# Altium project STM32 Flight Controller.PrjPcb
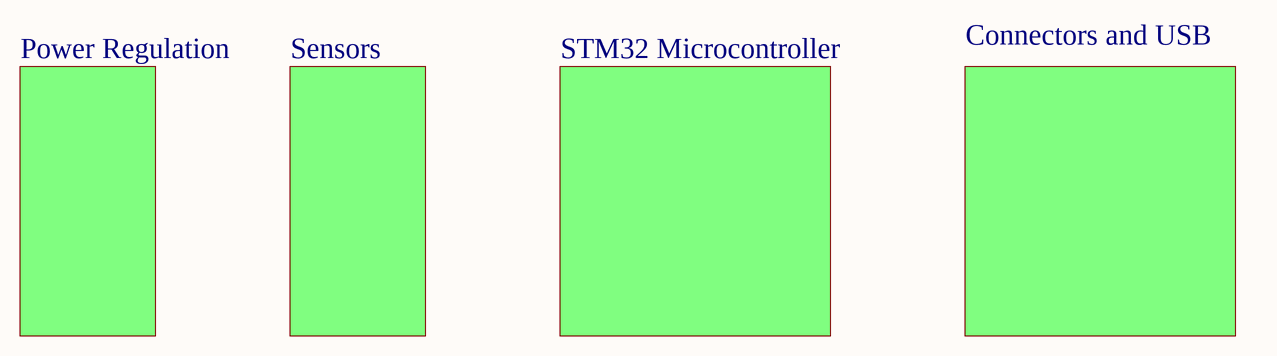
[diagram p0: Top Level.SchDoc]
5 sheets, 52 parts. Net scope: global (net labels, ports and power ports of the same name join across sheets).
Board file: FlightController.PcbDoc
Sheets:
  Top Level.SchDoc
    STM32 Microcontroller = STM32.SchDoc
    Connectors and USB = Connectors and USB.SchDoc
    Sensors = Sensors.SchDoc
    Power Regulation = Power Regulation.SchDoc

## Sheet Top Level.SchDoc: Top Level
size A4; DrawnBy: Alex Dyer; Revision: A; SheetNumber: 1; SheetTotal: 5

### Sub-sheets
Connectors and USB = Connectors and USB.SchDoc: no entries
Power Regulation = Power Regulation.SchDoc: no entries
Sensors = Sensors.SchDoc: no entries
STM32 Microcontroller = STM32.SchDoc: no entries

### Notes on the sheet
- Title:
- Size:
- Date:
- A4
- Drawn By:
- Time:
- Sheet
- Revision:
- of

## Sheet STM32.SchDoc: STM32
size A4; DrawnBy: Alex Dyer; Revision: A; SheetNumber: 2; SheetTotal: 5
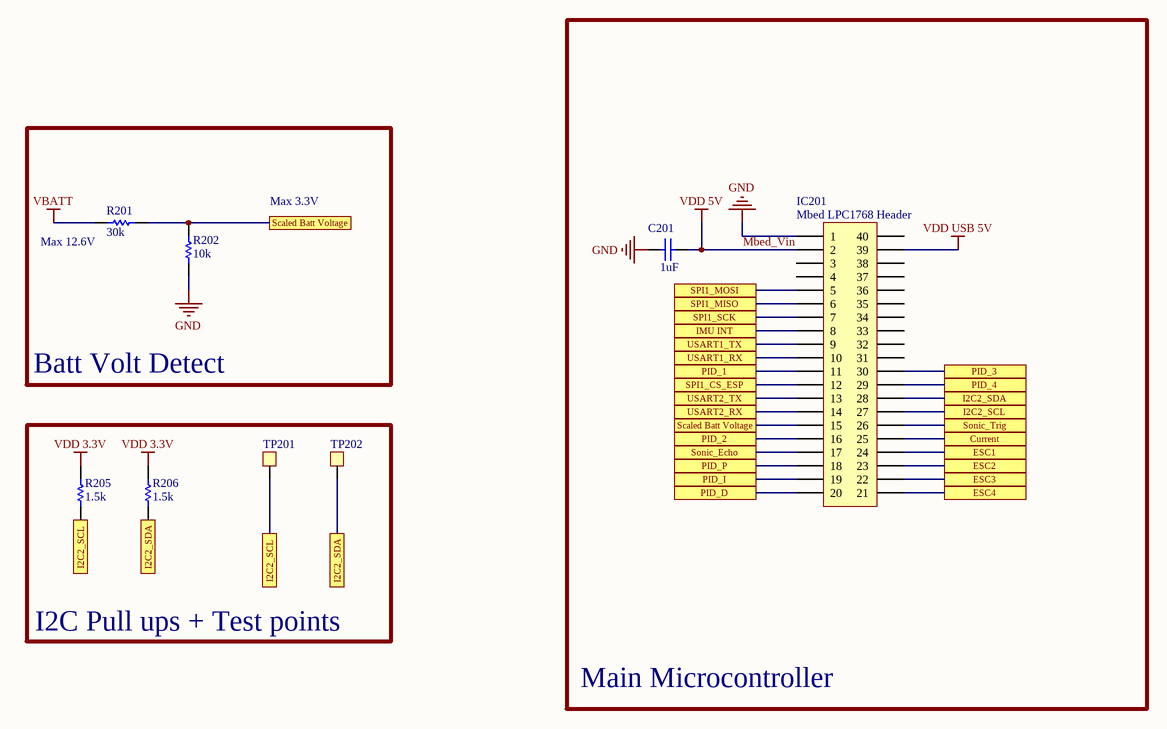
[diagram p1: STM32.SchDoc]

### Parts
C201  value 1uF  [0805 Cap]  (hidden comment: 0805)
IC201  Mbed LPC1768 Header  [Mbed LPC1768]
R201  value 30k  [0603]  (hidden comment: 0603)
R202  value 10k  [0603]  (hidden comment: 0603)
R205  value 1.5k  [0603]  (hidden comment: 0603)
R206  value 1.5k  [0603]  (hidden comment: 0603)
TP201  Test Point  [Test Point THT 1mm]  (value not drawn)
TP202  Test Point  [Test Point THT 1mm]  (value not drawn)

### Blocks framed on the sheet
Main Microcontroller: C201 IC201
Batt Volt Detect: R201 R202
I2C Pull ups + Test points: R205 R206 TP201 TP202

### Ports
Current, ESC1, ESC2, ESC3, ESC4, I2C2_SCL, I2C2_SDA, IMU INT, PID_1, PID_2, PID_3, PID_4, PID_D, PID_I, PID_P, Scaled Batt Voltage, Sonic_Echo, Sonic_Trig, SPI1_CS_ESP, SPI1_MISO, SPI1_MOSI, SPI1_SCK, USART1_RX, USART1_TX, USART2_RX, USART2_TX

### Nets
GND: C201.2 IC201.1 R202.2
Mbed_Vin: C201.1 IC201.2  [also labelled VDD 5V]
VBATT: R201.1
VDD 3.3V: R205.1 R206.1
VDD USB 5V: IC201.39
NetIC201_5: IC201.5 ; port SPI1_MOSI
NetIC201_6: IC201.6 ; port SPI1_MISO
NetIC201_7: IC201.7 ; port SPI1_SCK
NetIC201_8: IC201.8 ; port IMU INT
NetIC201_9: IC201.9 ; port USART1_TX
NetIC201_10: IC201.10 ; port USART1_RX
NetIC201_11: IC201.11 ; port PID_1
NetIC201_12: IC201.12 ; port SPI1_CS_ESP
NetIC201_13: IC201.13 ; port USART2_TX
NetIC201_14: IC201.14 ; port USART2_RX
NetIC201_15: IC201.15 R201.2 R202.1 ; port Scaled Batt Voltage
NetIC201_16: IC201.16 ; port PID_2
NetIC201_17: IC201.17 ; port Sonic_Echo
NetIC201_18: IC201.18 ; port PID_P
NetIC201_19: IC201.19 ; port PID_I
NetIC201_20: IC201.20 ; port PID_D
NetIC201_21: IC201.21 ; port ESC4
NetIC201_22: IC201.22 ; port ESC3
NetIC201_23: IC201.23 ; port ESC2
NetIC201_24: IC201.24 ; port ESC1
NetIC201_25: IC201.25 ; port Current
NetIC201_26: IC201.26 ; port Sonic_Trig
NetIC201_27: IC201.27 R205.2 TP201.1 ; port I2C2_SCL
NetIC201_28: IC201.28 R206.2 TP202.1 ; port I2C2_SDA
NetIC201_29: IC201.29 ; port PID_4
NetIC201_30: IC201.30 ; port PID_3

Not connected (* = marked no-connect by the designer): IC201 3 4 31 32 33 34 35 36 37 38 40

### Notes on the sheet
- (near R201) Max 12.6V
- Max 3.3V
- Title:
- Size:
- Date:
- A4
- Drawn By:
- Time:
- Sheet
- Revision:
- of

### Library data of the parts
C201 = Cap: Capacitor Box; Published: 8-Jun-2000; LatestRevisionDate: 17-Jul-2002; LatestRevisionNote: Re-released for DXP Platform.; PackageReference: RAD-0.3; Publisher: Altium Limited; PackageDescription: Radial Cap, Thru-Hole; 2 Leads; 0.3 in Pin Spacing; Catalogue No.: Capacitor Box
IC201 = Header 20X2: https://www.mouser.co.uk/ProductDetail/3M-Electronic-Solutions-Division/929850-01-20-RB?qs=sGAEpiMZZMs%252BGHln7q6pmzzqnf3%2F1AeI8GQqYPHkSyE%3D; Catalogue No.: 517-929850-01-20-RB; LatestRevisionDate: 17-Jul-2002; LatestRevisionNote: Re-released for DXP Platform.; Publisher: Altium Limited; Headers: 929850-01-20-RB
R201 R202 R205 R206 = Res1: Resistor; Published: 8-Jun-2000; LatestRevisionDate: 17-Jul-2002; LatestRevisionNote: Re-released for DXP Platform.; PackageReference: AXIAL-0.3; Publisher: Altium Limited; PackageDescription: Axial Device, Thru-Hole; 2 Leads; 0.3 in Pin Spacing; ComponentLink1Description: Purcahse; ComponentLink1URL: https://uk.rs-online.com/web/p/mlccs-multilayer-ceramic-capacitors/2644236/; Purchase: https://uk.rs-online.com/web/p/mlccs-multilayer-ceramic-capacitors/2644236/
TP201 TP202 = Test Point: ComponentLink1Description: Purchase; ComponentLink1URL: https://uk.rs-online.com/web/p/terminal-posts/2622179/?relevancy-data=7365617263685F636173636164655F6F726465723D31267365617263685F696E746572666163655F6E616D653D4931384E525353746F636B4E756D626572267365617263685F6C616E67756167655F757365643D656E267365617263685F6D617463685F6D6F64653D6D61746368616C6C267365617263685F7061747465726E5F6D6174636865643D5E2828282872737C5253295B205D3F293F285C647B337D5B5C2D5C735D3F5C647B332C347D5B705061415D3F29297C283235285C647B387D7C5C647B317D5C2D5C647B377D29292924267365617263685F7061747465726E5F6F726465723D31267365617263685F73745F6E6F726D616C697365643D59267365617263685F726573706F6E73655F616374696F6E3D267365617263685F747970653D52535F53544F434B5F4E554D424552267365617263685F77696C645F63617264696E675F6D6F64653D4E4F4E45267365617263685F6B6579776F72643D3236322D32313739267365617263685F6B6579776F72645F6170703D32363232313739267365617263685F636F6E6669673D3026&searchHistory=%7B%22enabled%22%3Atrue%7D\; Purchase: https://uk.rs-online.com/web/p/terminal-posts/2622179/?relevancy-data=7365617263685F636173636164655F6F726465723D31267365617263685F696E746572666163655F6E616D653D4931384E525353746F636B4E756D626572267365617263685F6C616E67756167655F757365643D656E267365617263685F6D617463685F6D6F64653D6D61746368616C6C267365617263685F7061747465726E5F6D6174636865643D5E2828282872737C5253295B205D3F293F285C647B337D5B5C2D5C735D3F5C647B332C347D5B705061415D3F29297C283235285C647B387D7C5C647B317D5C2D5C647B377D29292924267365617263685F7061747465726E5F6F726465723D31267365617263685F73745F6E6F726D616C697365643D59267365617263685F726573706F6E73655F616374696F6E3D267365617263685F747970653D52535F53544F434B5F4E554D424552267365617263685F77696C645F63617264696E675F6D6F64653D4E4F4E45267365617263685F6B6579776F72643D3236322D32313739267365617263685F6B6579776F72645F6170703D32363232313739267365617263685F636F6E6669673D3026&searchHistory=%7B%22enabled%22%3Atrue%7D\

## Sheet Connectors and USB.SchDoc: Connectors and USB
size A4; DrawnBy: Alex Dyer; Revision: A; SheetNumber: 3; SheetTotal: 5
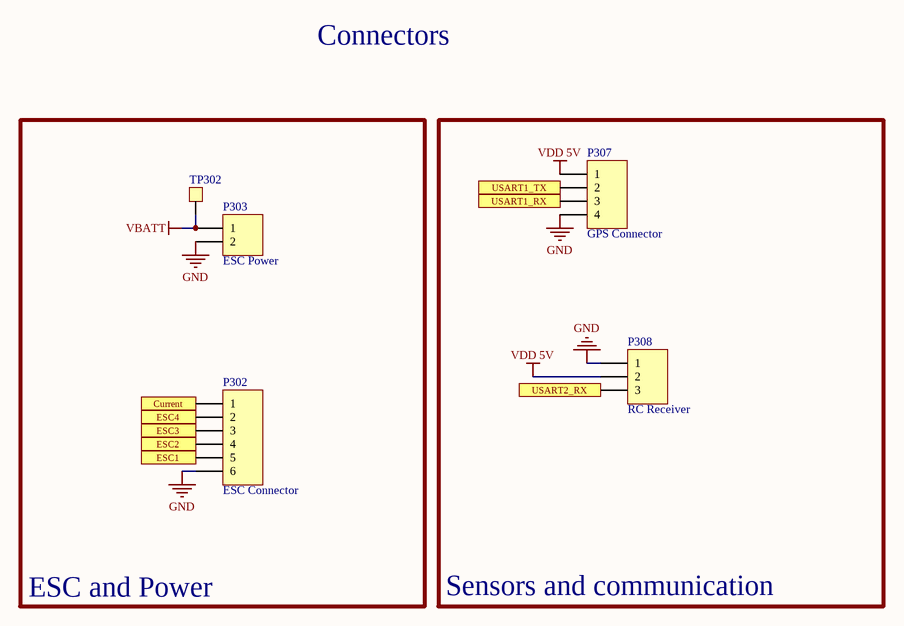
[diagram p2: Connectors and USB.SchDoc]

### Parts
P302  ESC Connector  [B6B-XH-A]
P303  ESC Power  [HDR1X2]
P307  GPS Connector  [B4B-XH-A]
P308  RC Receiver  [B3B-XH-A]
TP302  Test Point  [Test Point THT 1mm]  (value not drawn)

### Blocks framed on the sheet
ESC and Power: P302 P303 TP302
Sensors and communication: P307 P308

### Ports
Current, ESC1, ESC2, ESC3, ESC4, USART1_RX, USART1_TX, USART2_RX

### Nets
GND: P302.6 P303.2 P307.4 P308.1
VBATT: P303.1 TP302.1
VDD 5V: P307.1 P308.2  [project net Mbed_Vin]
NetIC201_9: P307.2 ; port USART1_TX
NetIC201_10: P307.3 ; port USART1_RX
NetIC201_14: P308.3 ; port USART2_RX
NetIC201_21: P302.2 ; port ESC4
NetIC201_22: P302.3 ; port ESC3
NetIC201_23: P302.4 ; port ESC2
NetIC201_24: P302.5 ; port ESC1
NetIC201_25: P302.1 ; port Current

### Notes on the sheet
- Connectors
- Title:
- Size:
- Date:
- A4
- Drawn By:
- Time:
- Sheet
- Revision:
- of

### Library data of the parts
P302 = Header 6: Header, 6-Pin; LatestRevisionDate: 17-Jul-2002; LatestRevisionNote: Re-released for DXP Platform.; Publisher: Altium Limited; Purchase: https://uk.farnell.com/jst-japan-solderless-terminals/b6b-xh-a-lf-sn/connector-header-tht-2-5mm-6way/dp/1516282?ost=b6b-xh-a
P303 = Header 2: Header, 2-Pin; LatestRevisionDate: 17-Jul-2002; LatestRevisionNote: Re-released for DXP Platform.; Publisher: Altium Limited; Purchase: https://hobbyking.com/en_us/nylon-xt60-connectors-male-female-5-pairs-genuine.html?___store=en_us
P307 = Header 4: Header, 4-Pin; LatestRevisionDate: 17-Jul-2002; LatestRevisionNote: Re-released for DXP Platform.; Publisher: Altium Limited; Purchase: https://uk.farnell.com/jst-japan-solderless-terminals/b4b-xh-a-lf-sn/header-vertical-4way/dp/1516278?st=b4b-xh-a
P308 = Header 3: Header, 3-Pin; LatestRevisionDate: 17-Jul-2002; LatestRevisionNote: Re-released for DXP Platform.; Publisher: Altium Limited; Purchase: https://uk.farnell.com/jst-japan-solderless-terminals/b3b-xh-a-lf-sn/header-vertical-3way/dp/1516277?ost=b3b-xh-a
TP302 = Test Point: ComponentLink1Description: Purchase; ComponentLink1URL: https://uk.rs-online.com/web/p/terminal-posts/2622179/?relevancy-data=7365617263685F636173636164655F6F726465723D31267365617263685F696E746572666163655F6E616D653D4931384E525353746F636B4E756D626572267365617263685F6C616E67756167655F757365643D656E267365617263685F6D617463685F6D6F64653D6D61746368616C6C267365617263685F7061747465726E5F6D6174636865643D5E2828282872737C5253295B205D3F293F285C647B337D5B5C2D5C735D3F5C647B332C347D5B705061415D3F29297C283235285C647B387D7C5C647B317D5C2D5C647B377D29292924267365617263685F7061747465726E5F6F726465723D31267365617263685F73745F6E6F726D616C697365643D59267365617263685F726573706F6E73655F616374696F6E3D267365617263685F747970653D52535F53544F434B5F4E554D424552267365617263685F77696C645F63617264696E675F6D6F64653D4E4F4E45267365617263685F6B6579776F72643D3236322D32313739267365617263685F6B6579776F72645F6170703D32363232313739267365617263685F636F6E6669673D3026&searchHistory=%7B%22enabled%22%3Atrue%7D\; Purchase: https://uk.rs-online.com/web/p/terminal-posts/2622179/?relevancy-data=7365617263685F636173636164655F6F726465723D31267365617263685F696E746572666163655F6E616D653D4931384E525353746F636B4E756D626572267365617263685F6C616E67756167655F757365643D656E267365617263685F6D617463685F6D6F64653D6D61746368616C6C267365617263685F7061747465726E5F6D6174636865643D5E2828282872737C5253295B205D3F293F285C647B337D5B5C2D5C735D3F5C647B332C347D5B705061415D3F29297C283235285C647B387D7C5C647B317D5C2D5C647B377D29292924267365617263685F7061747465726E5F6F726465723D31267365617263685F73745F6E6F726D616C697365643D59267365617263685F726573706F6E73655F616374696F6E3D267365617263685F747970653D52535F53544F434B5F4E554D424552267365617263685F77696C645F63617264696E675F6D6F64653D4E4F4E45267365617263685F6B6579776F72643D3236322D32313739267365617263685F6B6579776F72645F6170703D32363232313739267365617263685F636F6E6669673D3026&searchHistory=%7B%22enabled%22%3Atrue%7D\

## Sheet Sensors.SchDoc: Sensors
size A4; DrawnBy: Alex Dyer; Revision: A; SheetNumber: 4; SheetTotal: 5
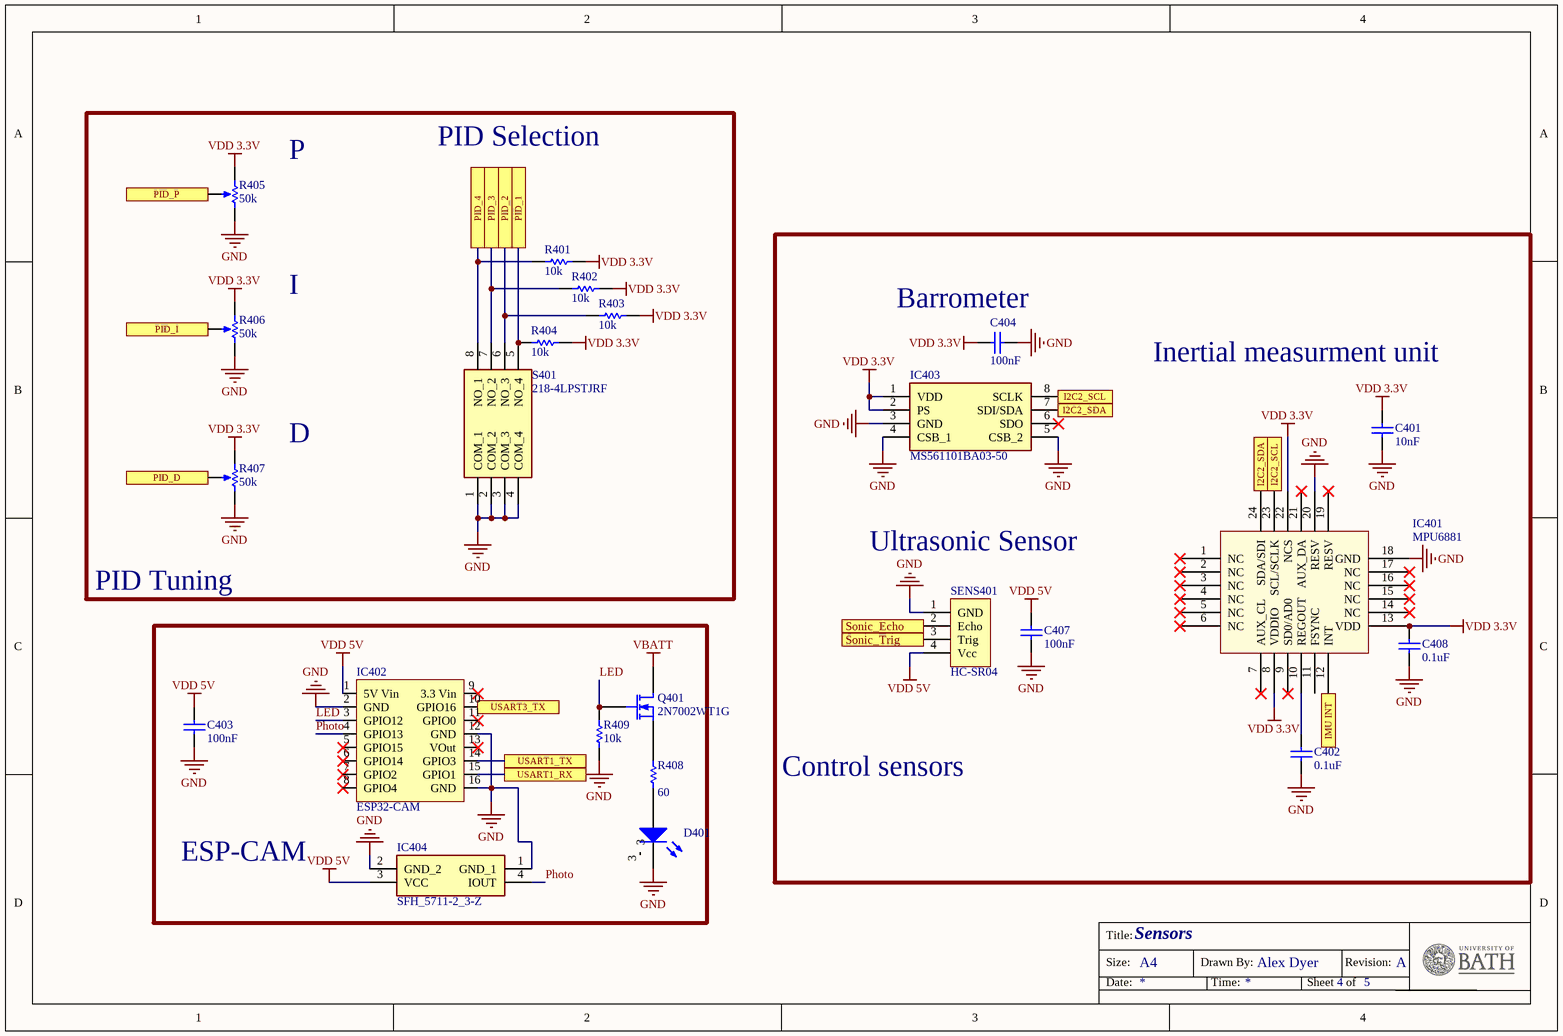
[diagram p3: Sensors.SchDoc]

### Parts
C401  value 10nF  [0805 Cap]  (hidden comment: Cap)
C402  value 0.1uF  [0805 Cap]  (hidden comment: Cap)
C403  value 100nF  [0805 Cap]  (hidden comment: Cap)
C404  value 100nF  [0805 Cap]  (hidden comment: Cap)
C407  value 100nF  [0805 Cap]  (hidden comment: Cap)
C408  value 0.1uF  [0805 Cap]  (hidden comment: Cap)
D401  XBDBLU-00-0000-000000201  [LED PAD]  (value not drawn)
IC401  MPU6881  [QFN40P300X300X105-25N-D]
IC402  ESP32-CAM  [ESP-CAM]
IC403  MS561101BA03-50  [MS561101BA03-50]
IC404  SFH_5711-2_3-Z  [SFH571123Z]
Q401  2N7002WT1G  [2N7002WT1G]
R401  value 10k  [0603]  (hidden comment: 0603)
R402  value 10k  [0603]  (hidden comment: 0603)
R403  value 10k  [0603]  (hidden comment: 0603)
R404  value 10k  [0603]  (hidden comment: 0603)
R405  value 50k  [TRIM_POT Bourns 3296]  (hidden comment: RPot)
R406  value 50k  [TRIM_POT Bourns 3296]  (hidden comment: RPot)
R407  value 50k  [TRIM_POT Bourns 3296]  (hidden comment: RPot)
R408  value 60  [RESC6432X65N]  (hidden comment: CRGH2512J68R)
R409  value 10k  [0603]  (hidden comment: 0603)
S401  218-4LPSTJRF  [2184LPSTJRF]
SENS401  HC-SR04  [B4B-XH-A]

### Blocks framed on the sheet
ESP-CAM: C403 D401 IC402 IC404 Q401 R408 R409

### Ports
I2C2_SCL, I2C2_SDA, IMU INT, PID_1, PID_2, PID_3, PID_4, PID_D, PID_I, PID_P, Sonic_Echo, Sonic_Trig, USART1_RX, USART1_TX, USART3_TX

### Nets
GND: C401.1 C402.1 C403.1 C404.1 C407.1 C408.1 D401.2(K) IC401.18(GND) IC401.20(RESV) IC402.2(GND) IC402.12(GND) IC402.16(GND) IC403.3(GND) IC403.4(CSB_1) IC403.5(CSB_2) IC404.1(GND_1) IC404.2(GND_2) R405.2(BOT) R406.2(BOT) R407.2(BOT) R409.2 S401.1(COM_1) S401.2(COM_2) S401.3(COM_3) S401.4(COM_4) SENS401.1(GND)
VBATT: Q401.1(D)
VDD 3.3V: C401.2 C404.2 C408.2 IC401.8(VDDIO) IC401.13(VDD) IC401.22(NCS) IC403.1(VDD) IC403.2(PS) R401.1 R402.1 R403.1 R404.1 R405.1(TOP) R406.1(TOP) R407.1(TOP)
VDD 5V: C403.2 C407.2 IC402.1(5V_Vin) IC404.3(VCC) SENS401.4(Vcc)  [project net Mbed_Vin]
LED: IC402.3(GPIO12) Q401.2(G) R409.1
Photo: IC402.4(GPIO13) IC404.4(IOUT)
NetC402_2: C402.2 IC401.10(REGOUT)
NetD401_1: D401.1(A) R408.1
NetIC201_8: IC401.12(INT) ; port IMU INT
NetIC201_9: IC402.14(GPIO3) ; port USART1_TX
NetIC201_10: IC402.15(GPIO1) ; port USART1_RX
NetIC201_11: R404.2 S401.5(NO_4) ; port PID_1
NetIC201_16: R403.2 S401.6(NO_3) ; port PID_2
NetIC201_17: SENS401.2(Echo) ; port Sonic_Echo
NetIC201_18: R405.3(TAP) ; port PID_P
NetIC201_19: R406.3(TAP) ; port PID_I
NetIC201_20: R407.3(TAP) ; port PID_D
NetIC201_26: SENS401.3(Trig) ; port Sonic_Trig
NetIC201_27: IC401.23(SCL/SCLK) IC403.8(SCLK) ; port I2C2_SCL
NetIC201_28: IC401.24(SDA/SDI) IC403.7(SDI/SDA) ; port I2C2_SDA
NetIC201_29: R401.2 S401.8(NO_1) ; port PID_4
NetIC201_30: R402.2 S401.7(NO_2) ; port PID_3
NetIC402_10: IC402.10(GPIO16) ; port USART3_TX
NetQ401_3: Q401.3(S) R408.2

Not connected (* = marked no-connect by the designer): D401 3; IC401 1(NC)* 2(NC)* 3(NC)* 4(NC)* 5(NC)* 6(NC)* 7(AUX_CL)* 9(SD0/AD0)* 11(FSYNC) 14(NC)* 15(NC)* 16(NC)* 17(NC)* 19(RESV)* 21(AUX_DA)*; IC402 5(GPIO15)* 6(GPIO14)* 7(GPIO2)* 8(GPIO4)* 9(3.3_Vin)* 11(GPIO0)* 13(VOut)*; IC403 6(SDO)*

### Notes on the sheet
- P
- PID Selection
- I
- (near C404) Barrometer
- Inertial measurment unit
- D
- Ultrasonic Sensor
- PID Tuning
- Control sensors
- Title:
- Size:
- Date:
- A4
- Drawn By:
- Time:
- Sheet
- Revision:
- of

### Library data of the parts
C401 C403 C404 C407 = Cap: Capacitor; Published: 8-Jun-2000; LatestRevisionDate: 17-Jul-2002; LatestRevisionNote: Re-released for DXP Platform.; PackageReference: RAD-0.3; Publisher: Altium Limited; PackageDescription: Radial Cap, Thru-Hole; 2 Leads; 0.3 in Pin Spacing; ComponentLink1Description: Purchase; ComponentLink1URL: https://uk.rs-online.com/web/p/mlccs-multilayer-ceramic-capacitors/6480957/; Purchase: https://uk.rs-online.com/web/p/mlccs-multilayer-ceramic-capacitors/6480957/
C402 C408 = Cap: Low ESR Capacitor; Published: 8-Jun-2000; LatestRevisionDate: 17-Jul-2002; LatestRevisionNote: Re-released for DXP Platform.; PackageReference: RAD-0.3; Publisher: Altium Limited; PackageDescription: Radial Cap, Thru-Hole; 2 Leads; 0.3 in Pin Spacing; ComponentLink1Description: Purchase; ComponentLink1URL: https://uk.rs-online.com/web/p/mlccs-multilayer-ceramic-capacitors/7883048/; Purchase: https://uk.rs-online.com/web/p/mlccs-multilayer-ceramic-capacitors/7883048/
D401 = LED1: https://www.mouser.co.uk/ProductDetail/Cree-LED/XBDBLU-00-0000-000000201?qs=L2F6Qc639cBX0No8%252B6LF0A%3D%3D; Published: 8-Jun-2000; LatestRevisionDate: 08-Jul-2005; LatestRevisionNote: Mech Layer 1 removed.; PackageReference: LED-1; Publisher: Altium Limited; PackageDescription: LED; 2 Leads
IC401 = MPU6881: https://www.mouser.co.uk/ProductDetail/TDK-InvenSense/MPU-6881?qs=u4fy%2FsgLU9MthFpyRcZ0%252Bg%3D%3D
IC402 = ESP-CAM
IC403 = MS561101BA03-50: Integrated Circuit Note, Mouser Chepaer; Manufacturer_Name: TE Connectivity; Datasheet Link: https://componentsearchengine.com//MS561101BA03-50.pdf; Mouser2 Part Number: 824-MS561101BA03-50; Mouser2 Price/Stock: https://www.mouser.com/Search/Refine.aspx?Keyword=824-MS561101BA03-50; Manufacturer_Part_Number: MS561101BA03-50; ComponentLink1Description: Purchase; ComponentLink1URL: https://uk.rs-online.com/web/p/pressure-sensor-ics/8937130/; Purchase: https://uk.rs-online.com/web/p/pressure-sensor-ics/8937130/
IC404 = SFH_5711-2_3-Z: https://www.mouser.co.uk/ProductDetail/ams-OSRAM/SFH-5711-2-3-Z?qs=K5ta8V%252BWhtZqF99oIrrnNw%3D%3D; Manufacturer_Name: OSRAM; Manufacturer_Part_Number: SFH 5711-2/3-Z; Datasheet Link: https://dammedia.osram.info/media/resource/hires/osram-dam-2496447/SFH%205711.pdf; Height: 1.25mm; Mouser Part Number: 720-SFH5711-2/3-Z; Mouser Price/Stock: https://www.mouser.co.uk/ProductDetail/OSRAM-Opto-Semiconductors/SFH-5711-2-3-Z?qs=K5ta8V%252BWhtZqF99oIrrnNw%3D%3D
Q401 = MOSFET-N: https://www.mouser.co.uk/ProductDetail/ON-Semiconductor/2N7002WT1G?qs=%2Fha2pyFadujPTHSYx5%2FnTbaF5MlOOaLYuqobFODOT4c%3D; Catalogue No.: 863-2N7002WT1G; Published: 8-Jun-2000; LatestRevisionDate: 17-Jul-2002; LatestRevisionNote: Re-released for DXP Platform.; PackageVersion: 1995/1996; PackageReference: E3; Publisher: Altium Limited; PackageDescription: TO, Flat Index; 3 In-Line, Axial Leads; Body Dia. 4.6mm; Lead Dia. 0.5 mm (max)
R401-R404 R409 = Res1: Resistor; Published: 8-Jun-2000; LatestRevisionDate: 17-Jul-2002; LatestRevisionNote: Re-released for DXP Platform.; PackageReference: AXIAL-0.3; Publisher: Altium Limited; PackageDescription: Axial Device, Thru-Hole; 2 Leads; 0.3 in Pin Spacing; ComponentLink1Description: Purcahse; Purchase: https://uk.rs-online.com/web/p/surface-mount-fixed-resistors/9013601/
  R401 R402 R404: ComponentLink1URL: https://uk.rs-online.com/web/p/mlccs-multilayer-ceramic-capacitors/2644236/
  R403 R409: ComponentLink1URL: https://uk.rs-online.com/web/p/surface-mount-fixed-resistors/9013601/
R405-R407 = RPot: https://uk.rs-online.com/web/p/trimmer-resistors/5219805/; Sim Note: Enter the Resistance value and the set point into parameter fields.; Set Position: 0.5; Published: 8-Jun-2000; LatestRevisionDate: 17-Jul-2002; LatestRevisionNote: Re-released for DXP Platform.; PackageReference: VR5; Publisher: Altium Limited; PackageDescription: Variable Resistor, Thru-Hole; 3 Leads
R408 = Res1: https://www.mouser.co.uk/ProductDetail/TE-Connectivity-Holsworthy/CRGH2512J68R?qs=HLeXuo0aL2q34i8u56pcOQ%3D%3D; Published: 8-Jun-2000; LatestRevisionDate: 17-Jul-2002; LatestRevisionNote: Re-released for DXP Platform.; PackageReference: AXIAL-0.3; Publisher: Altium Limited; PackageDescription: Axial Device, Thru-Hole; 2 Leads; 0.3 in Pin Spacing
S401 = 218-4LPSTJRF: DIP Switches/SIP Switches SURFACE MOUNT, GOLD, HALF-PITCH DIP SWITCH, 4-POLE, LOW PROFILE ACTUATOR, BOTTOM SEAL, TAPE SEAL, J-BEND, REEL, OFF; Manufacturer_Name: CTS; Datasheet Link: https://www.ctscorp.com/wp-content/uploads/218.pdf; Height: 2.7mm; Manufacturer_Part_Number: 218-4LPSTJRF; Purchase: https://www.mouser.co.uk/ProductDetail/CTS-Electronic-Components/218-4LPSTJRF?qs=%2Fha2pyFadug5kYncPhJ9FkmRH7GTEiEUUQMrCssHcOgjfy8aTjLtCQ%3D%3D
SENS401 = Header 4: Ultrasonic Distance Sensor; LatestRevisionDate: 17-Jul-2002; LatestRevisionNote: Re-released for DXP Platform.; Publisher: Altium Limited; Purchase: https://www.sparkfun.com/products/15569; Parameter 1: *

## Sheet Power Regulation.SchDoc: Power Regulation
size A4; DrawnBy: Alex Dyer; Revision: A; SheetNumber: 5; SheetTotal: 5
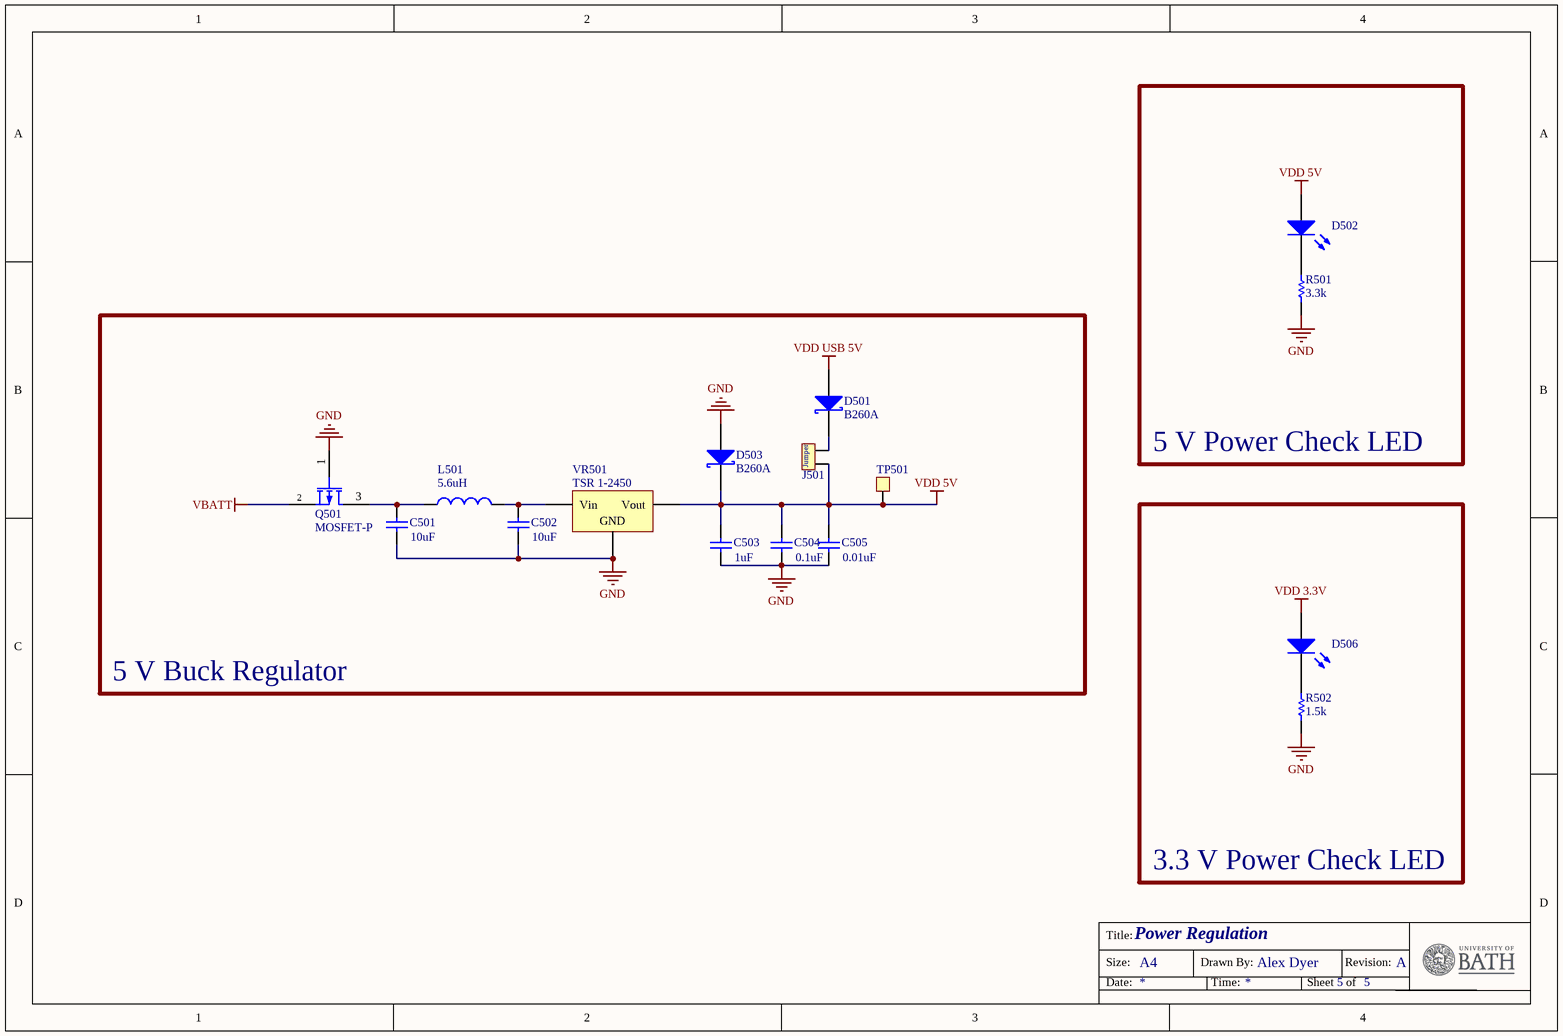
[diagram p4: Power Regulation.SchDoc]

### Parts
C501  value 10uF  [0805 Cap]  (hidden comment: C2012X5R1V106K085AC)
C502  value 10uF  [0805 Cap]  (hidden comment: C2012X5R1V106K085AC)
C503  value 1uF  [0805 Cap]  (hidden comment: C2012X5R1V106K085AC)
C504  value 0.1uF  [0805 Cap]  (hidden comment: C2012X5R1V106K085AC)
C505  value 0.01uF  [0805 Cap]  (hidden comment: C2012X5R1V106K085AC)
D501  B260A  [SMA (DO-214AC)]
D502  LED2  [SML-211 Series]  (value not drawn)
D503  B260A  [SMA (DO-214AC)]
D506  LED2  [SML-211 Series]  (value not drawn)
J501  Jumper  [2.54mm 2 pin Jumper]  (value not drawn)
L501  value 5.6uH  [SRR1280A]  (hidden comment: SRR1280A-331K)
Q501  MOSFET-P  [SOT95P230X110-3N]
R501  value 3.3k  [0603]  (hidden comment: 0603)
R502  value 1.5k  [0603]  (hidden comment: 0603)
TP501  Test Point  [Test Point THT 1mm]  (value not drawn)
VR501  TSR 1-2450  [TRACOPOWER TSR]

### Blocks framed on the sheet
5 V Power Check LED: D502 R501
5 V Buck Regulator: C501-C505 D501 D503 J501 L501 Q501 TP501 VR501
3.3 V Power Check LED: D506 R502

### Nets
GND: C501.1 C502.1 C503.1 C504.1 C505.1 D503.1(A) Q501.1(G) R501.1 R502.1 VR501.2(GND)
VBATT: Q501.2(S)
VDD 3.3V: D506.1(A)
VDD 5V: C503.2 C504.2 C505.2 D502.1(A) D503.2(K) J501.2 TP501.1 VR501.3(Vout)  [project net Mbed_Vin]
VDD USB 5V: D501.1(A)
NetC501_2: C501.2 L501.1 Q501.3(D)
NetC502_2: C502.2 L501.2 VR501.1(Vin)
NetD501_2: D501.2(K) J501.1
NetD502_2: D502.2(K) R501.2
NetD506_2: D506.2(K) R502.2

### Notes on the sheet
- Title:
- Size:
- Date:
- A4
- Drawn By:
- Time:
- Sheet
- Revision:
- of

### Library data of the parts
C501-C505 = Cap: https://uk.rs-online.com/web/p/mlccs-multilayer-ceramic-capacitors/9159325/?relevancy-data=636F3D3126696E3D4931384E525353746F636B4E756D626572266C753D656E266D6D3D6D61746368616C6C26706D3D5E2828282872737C5253295B205D3F293F285C647B337D5B5C2D5C735D3F5C647B332C347D5B705061415D3F29297C283235285C647B387D7C5C647B317D5C2D5C647B377D2929292426706F3D3126736E3D592673723D2673743D52535F53544F434B5F4E554D4245522677633D4E4F4E45267573743D3931352D39333235267374613D3931353933323526&searchHistory=%7B%22enabled%22%3Atrue%7D; Catalogue No.: 766-1217; Published: 8-Jun-2000; LatestRevisionDate: 17-Jul-2002; LatestRevisionNote: Re-released for DXP Platform.; PackageReference: RAD-0.3; Publisher: Altium Limited; PackageDescription: Radial Cap, Thru-Hole; 2 Leads; 0.3 in Pin Spacing
D501 D503 = D Schottky: Schottky Diode; ComponentLink1Description: Purchase; ComponentLink1URL: https://www.mouser.co.uk/ProductDetail/Diodes-Incorporated/B260A-13-F?qs=9XwZYT68TnR%252B3fnyovGFLA%3D%3D; Purchase: https://www.mouser.co.uk/ProductDetail/Diodes-Incorporated/B260A-13-F?qs=9XwZYT68TnR%252B3fnyovGFLA%3D%3D
D502 D506 = LED2: Typical RED, GREEN, YELLOW, AMBER GaAs LED; ComponentLink1Description: Purchase; ComponentLink1URL: https://uk.rs-online.com/web/p/leds/7007897/; Purchase: https://uk.rs-online.com/web/p/leds/7007897/
L501 = Inductor: https://www.mouser.co.uk/ProductDetail/Bourns/SRR1240-5R6M?qs=xrpI9KL%2FXvsXaYuKX%252BElwQ%3D%3D; Code_IEC: 1005; Catalogue No.: 652-SRR1280A-331K; Published: 8-Jun-2000; LatestRevisionDate: 29-May-2009; LatestRevisionNote: IPC-7351 Footprint Added.; PackageReference: 0402-A; Publisher: Altium Limited; PackageDescription: Chip Inductor; Code_JEITA: 0402
Q501 = MOSFET-P: P-Channel MOSFET; ComponentLink1Description: Purchase; ComponentLink1URL: https://www.mouser.co.uk/ProductDetail/Nexperia/PMV250EPEAR?qs=Yna0arPQ0CTtAa8k6X9CyQ%3D%3D; Purchase: https://www.mouser.co.uk/ProductDetail/Nexperia/PMV250EPEAR?qs=Yna0arPQ0CTtAa8k6X9CyQ%3D%3D
R501 R502 = Res1: Resistor; Published: 8-Jun-2000; LatestRevisionDate: 17-Jul-2002; LatestRevisionNote: Re-released for DXP Platform.; PackageReference: AXIAL-0.3; Publisher: Altium Limited; PackageDescription: Axial Device, Thru-Hole; 2 Leads; 0.3 in Pin Spacing; ComponentLink1Description: Purcahse; ComponentLink1URL: https://uk.rs-online.com/web/p/mlccs-multilayer-ceramic-capacitors/2644236/; Purchase: https://uk.rs-online.com/web/p/mlccs-multilayer-ceramic-capacitors/2644236/
VR501 = Volt Reg: https://uk.farnell.com/tracopower/tsr-1-2450/converter-dc-dc-5v-1a-sip/dp/1696320; Catalogue No.: 666-4379; Published: 24-Mar-1999; LatestRevisionDate: 29-May-2009; LatestRevisionNote: IPC-7351 Footprint Added.; PackageReference: D2PAK; Publisher: Altium Limited; PackageDescription: 3-Pin Transistor Outline Package 2.54 mm Pitch, 15.1 mm Lead Span
J501 = Jumper: Purchase: https://www.mouser.co.uk/ProductDetail/Molex/22-28-5027?qs=l%252BWx29wYPrz7EnZr1XjkzQ%3D%3D
TP501 = Test Point: ComponentLink1Description: Purchase; ComponentLink1URL: https://uk.rs-online.com/web/p/terminal-posts/2622179/?relevancy-data=7365617263685F636173636164655F6F726465723D31267365617263685F696E746572666163655F6E616D653D4931384E525353746F636B4E756D626572267365617263685F6C616E67756167655F757365643D656E267365617263685F6D617463685F6D6F64653D6D61746368616C6C267365617263685F7061747465726E5F6D6174636865643D5E2828282872737C5253295B205D3F293F285C647B337D5B5C2D5C735D3F5C647B332C347D5B705061415D3F29297C283235285C647B387D7C5C647B317D5C2D5C647B377D29292924267365617263685F7061747465726E5F6F726465723D31267365617263685F73745F6E6F726D616C697365643D59267365617263685F726573706F6E73655F616374696F6E3D267365617263685F747970653D52535F53544F434B5F4E554D424552267365617263685F77696C645F63617264696E675F6D6F64653D4E4F4E45267365617263685F6B6579776F72643D3236322D32313739267365617263685F6B6579776F72645F6170703D32363232313739267365617263685F636F6E6669673D3026&searchHistory=%7B%22enabled%22%3Atrue%7D\; Purchase: https://uk.rs-online.com/web/p/terminal-posts/2622179/?relevancy-data=7365617263685F636173636164655F6F726465723D31267365617263685F696E746572666163655F6E616D653D4931384E525353746F636B4E756D626572267365617263685F6C616E67756167655F757365643D656E267365617263685F6D617463685F6D6F64653D6D61746368616C6C267365617263685F7061747465726E5F6D6174636865643D5E2828282872737C5253295B205D3F293F285C647B337D5B5C2D5C735D3F5C647B332C347D5B705061415D3F29297C283235285C647B387D7C5C647B317D5C2D5C647B377D29292924267365617263685F7061747465726E5F6F726465723D31267365617263685F73745F6E6F726D616C697365643D59267365617263685F726573706F6E73655F616374696F6E3D267365617263685F747970653D52535F53544F434B5F4E554D424552267365617263685F77696C645F63617264696E675F6D6F64653D4E4F4E45267365617263685F6B6579776F72643D3236322D32313739267365617263685F6B6579776F72645F6170703D32363232313739267365617263685F636F6E6669673D3026&searchHistory=%7B%22enabled%22%3Atrue%7D\

## Nets that join several sheets
GND: STM32 (C201.2 IC201.1 R202.2), Connectors and USB (P302.6 P303.2 P307.4 P308.1), Sensors (26 pins), Power Regulation (10 pins)
Mbed_Vin: STM32 (C201.1 IC201.2), Connectors and USB (P307.1 P308.2), Sensors (5 pins), Power Regulation (8 pins)
VBATT: STM32 (R201.1), Connectors and USB (P303.1 TP302.1), Sensors (Q401.1), Power Regulation (Q501.2)
VDD 3.3V: STM32 (R205.1 R206.1), Sensors (15 pins), Power Regulation (D506.1)
VDD USB 5V: STM32 (IC201.39), Power Regulation (D501.1)
NetIC201_8: STM32 (IC201.8), Sensors (IC401.12)
NetIC201_9: STM32 (IC201.9), Connectors and USB (P307.2), Sensors (IC402.14)
NetIC201_10: STM32 (IC201.10), Connectors and USB (P307.3), Sensors (IC402.15)
NetIC201_11: STM32 (IC201.11), Sensors (R404.2 S401.5)
NetIC201_14: STM32 (IC201.14), Connectors and USB (P308.3)
NetIC201_16: STM32 (IC201.16), Sensors (R403.2 S401.6)
NetIC201_17: STM32 (IC201.17), Sensors (SENS401.2)
NetIC201_18: STM32 (IC201.18), Sensors (R405.3)
NetIC201_19: STM32 (IC201.19), Sensors (R406.3)
NetIC201_20: STM32 (IC201.20), Sensors (R407.3)
NetIC201_21: STM32 (IC201.21), Connectors and USB (P302.2)
NetIC201_22: STM32 (IC201.22), Connectors and USB (P302.3)
NetIC201_23: STM32 (IC201.23), Connectors and USB (P302.4)
NetIC201_24: STM32 (IC201.24), Connectors and USB (P302.5)
NetIC201_25: STM32 (IC201.25), Connectors and USB (P302.1)
NetIC201_26: STM32 (IC201.26), Sensors (SENS401.3)
NetIC201_27: STM32 (IC201.27 R205.2 TP201.1), Sensors (IC401.23 IC403.8)
NetIC201_28: STM32 (IC201.28 R206.2 TP202.1), Sensors (IC401.24 IC403.7)
NetIC201_29: STM32 (IC201.29), Sensors (R401.2 S401.8)
NetIC201_30: STM32 (IC201.30), Sensors (R402.2 S401.7)